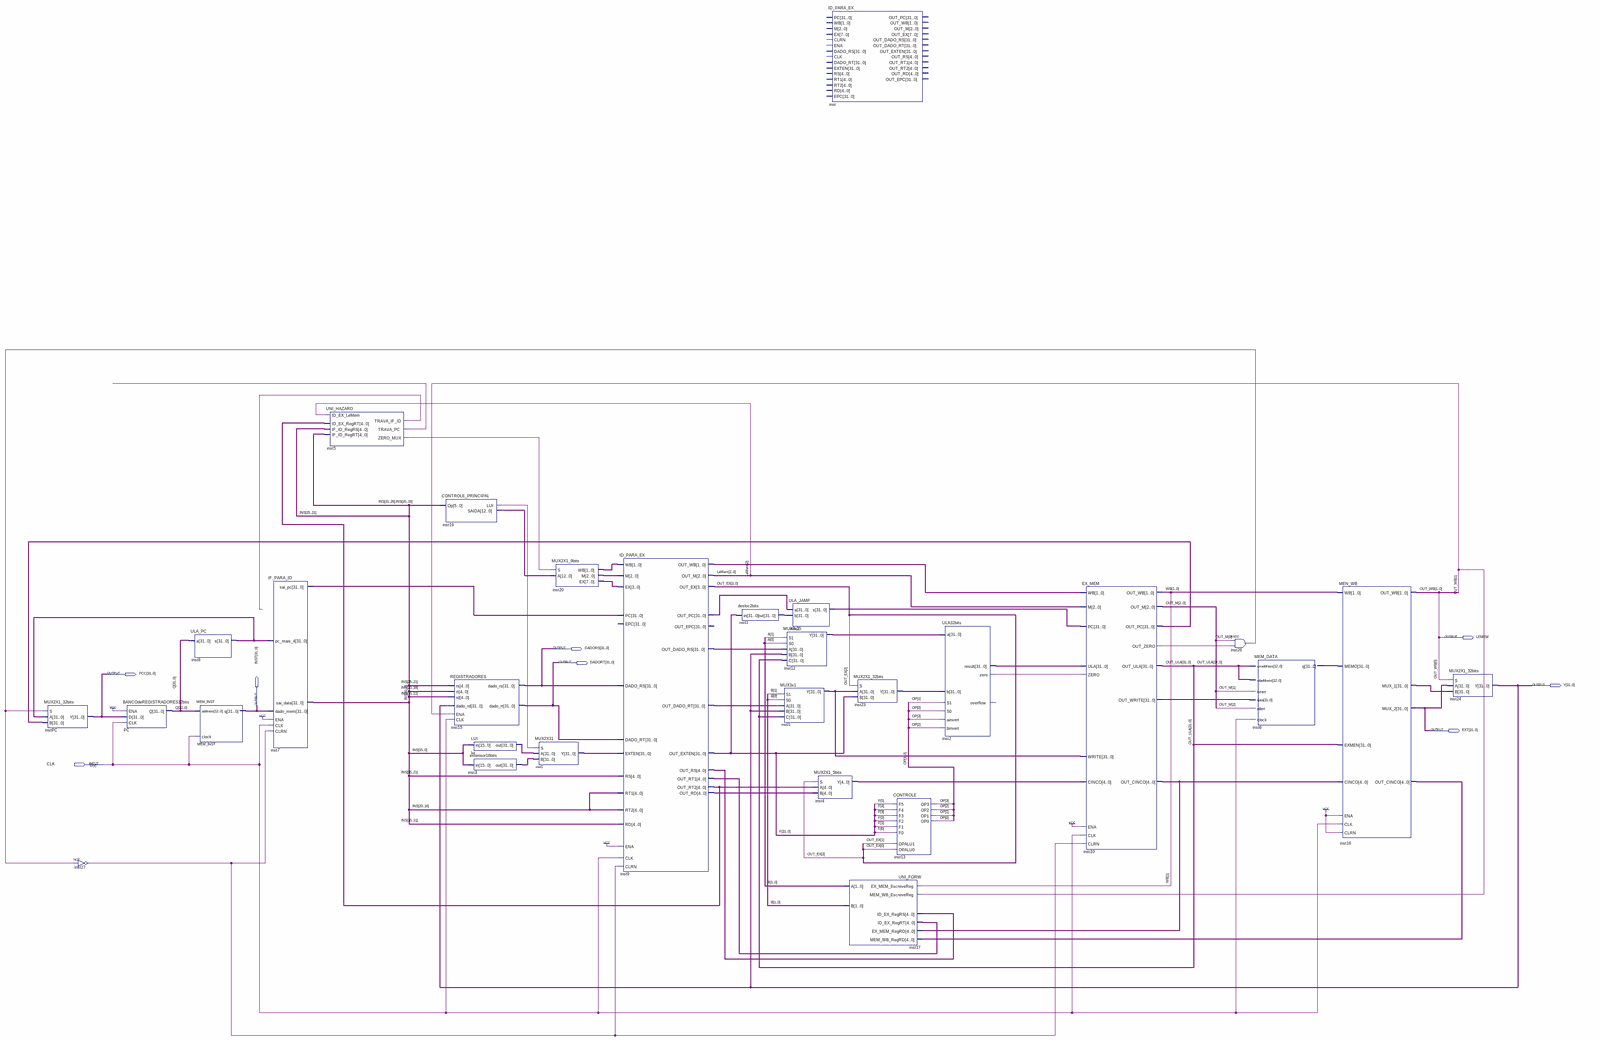
[diagram p0: schematic sheet, whole]
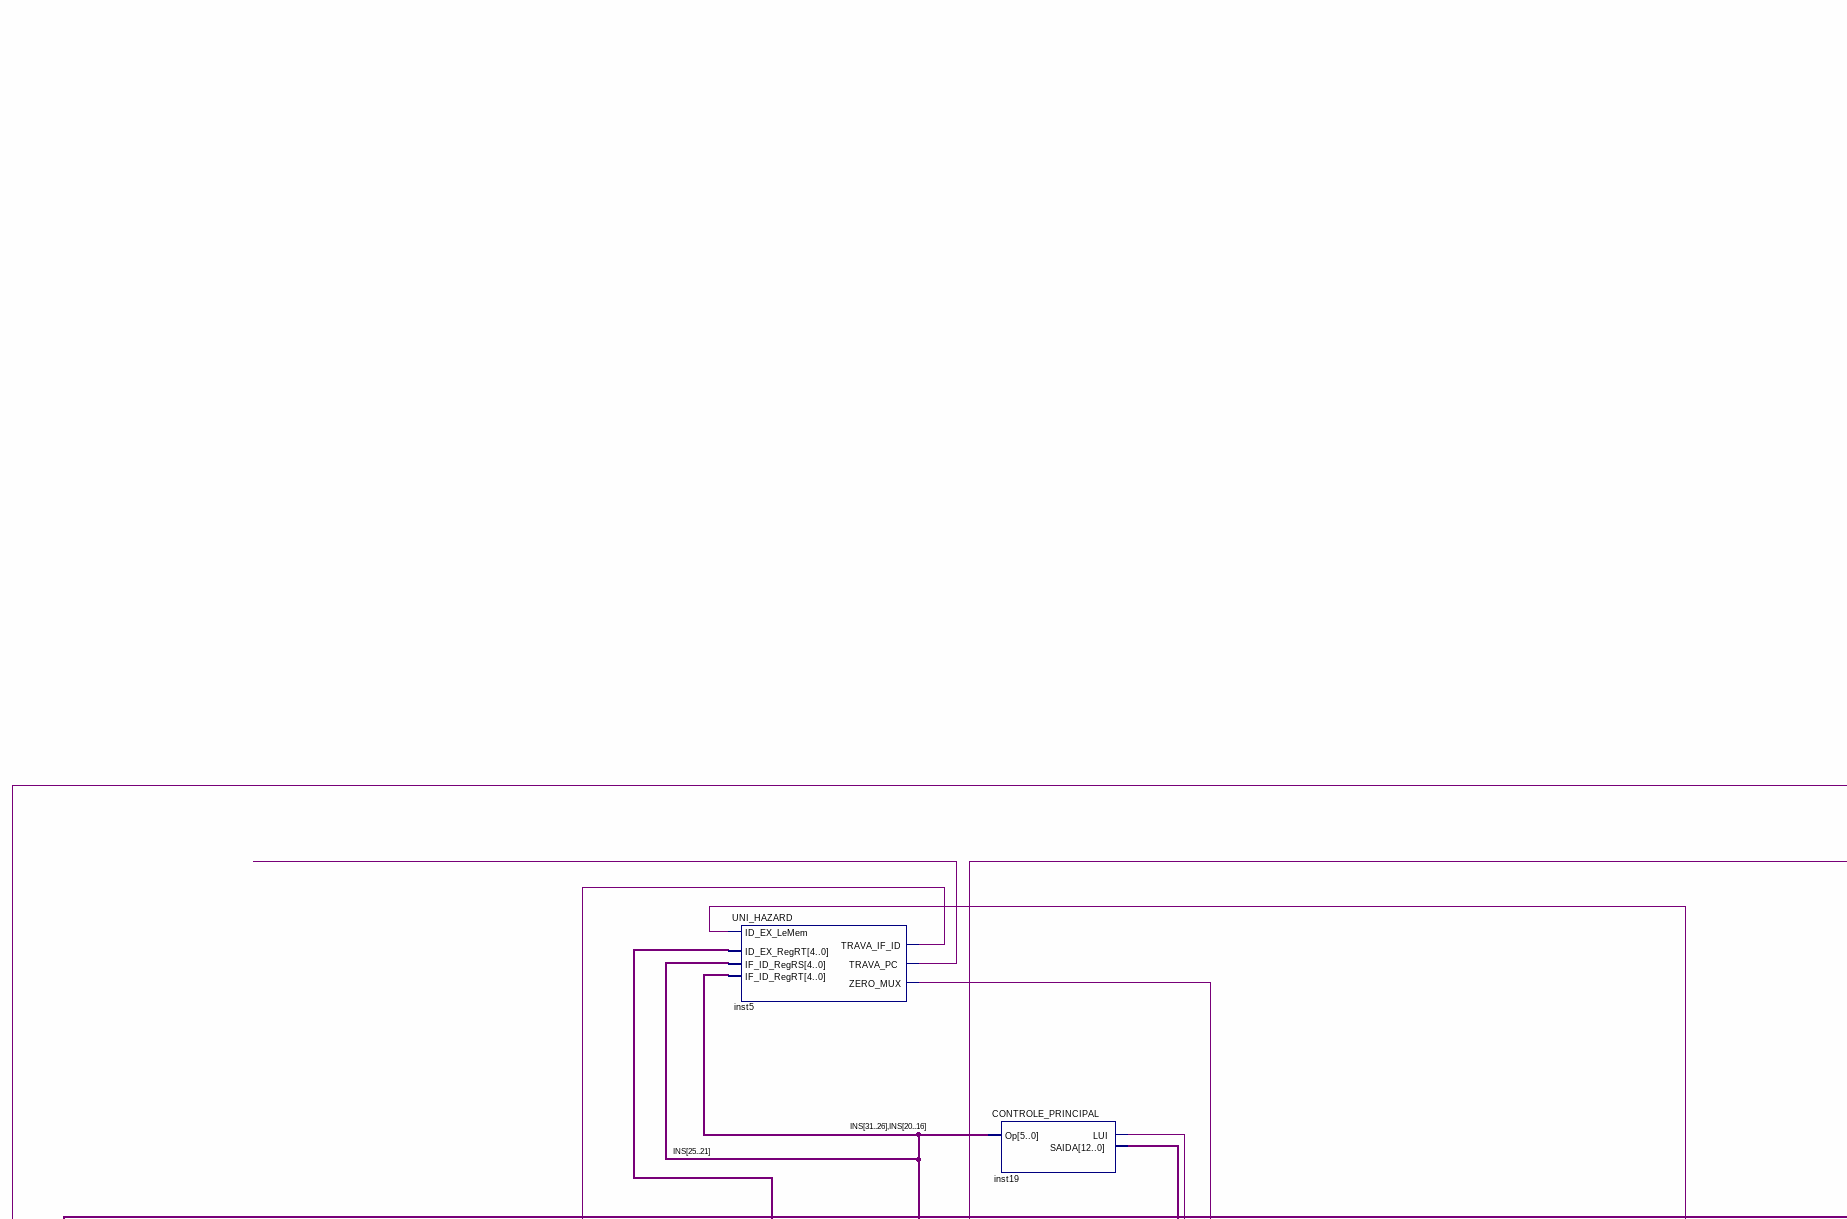
[diagram p1: schematic sheet, upper left part]
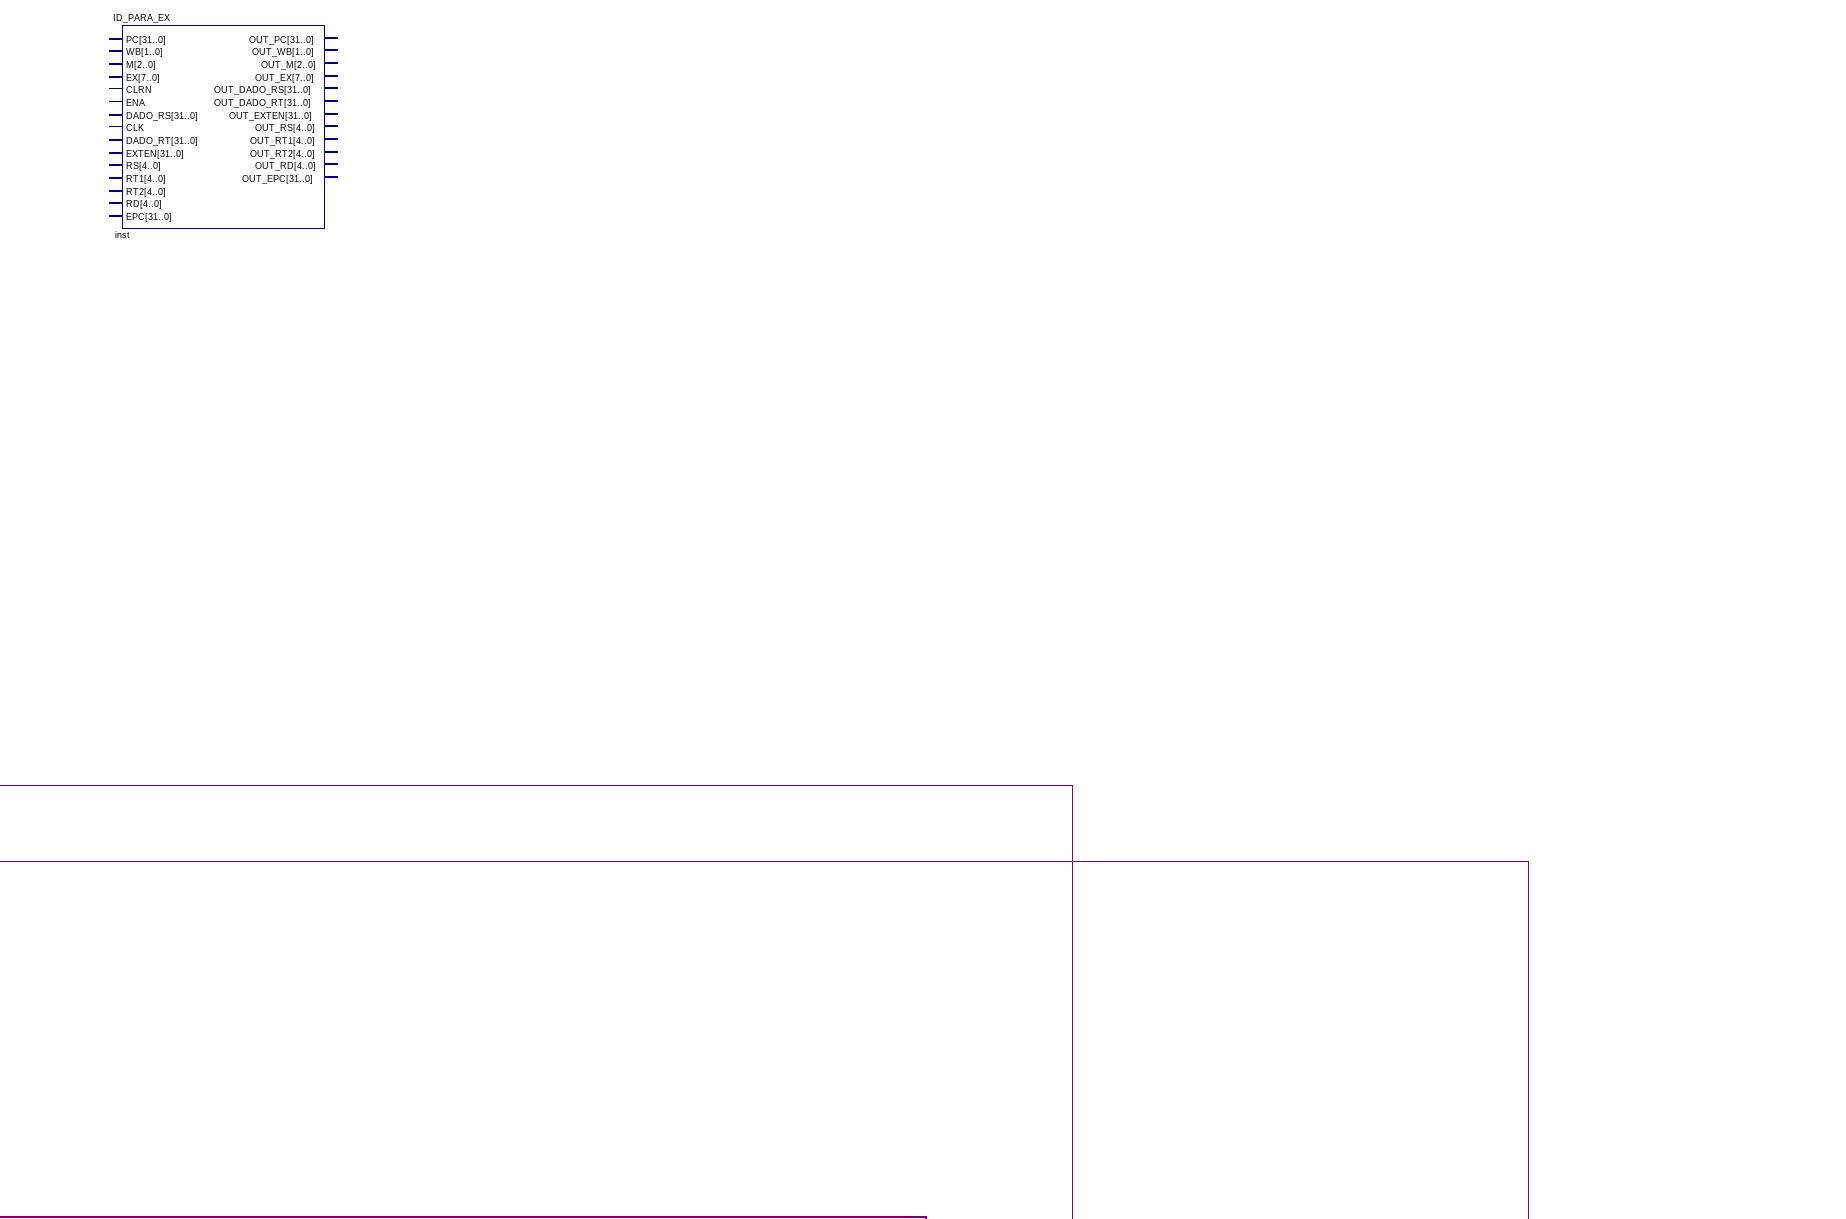
[diagram p2: schematic sheet, upper right part]
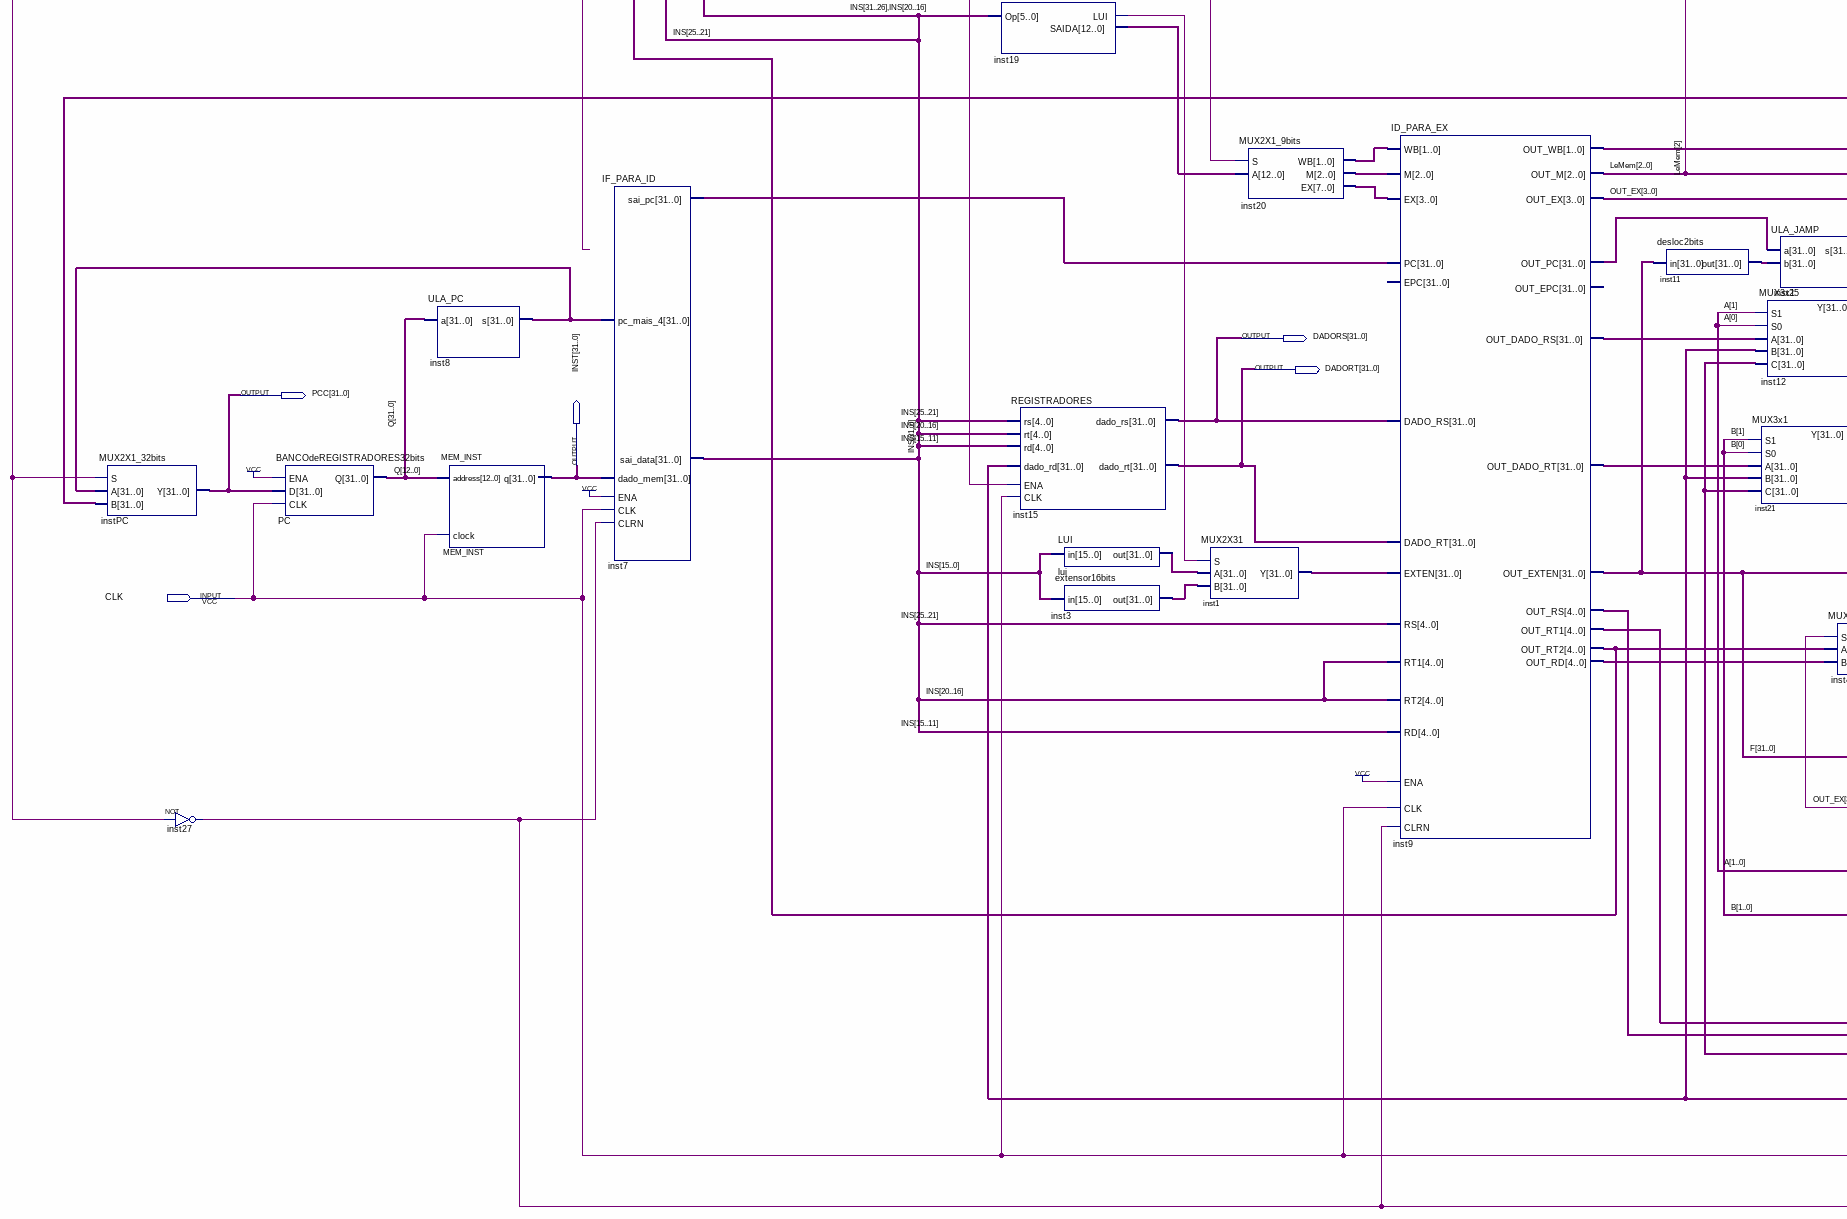
[diagram p3: schematic sheet, lower left part]
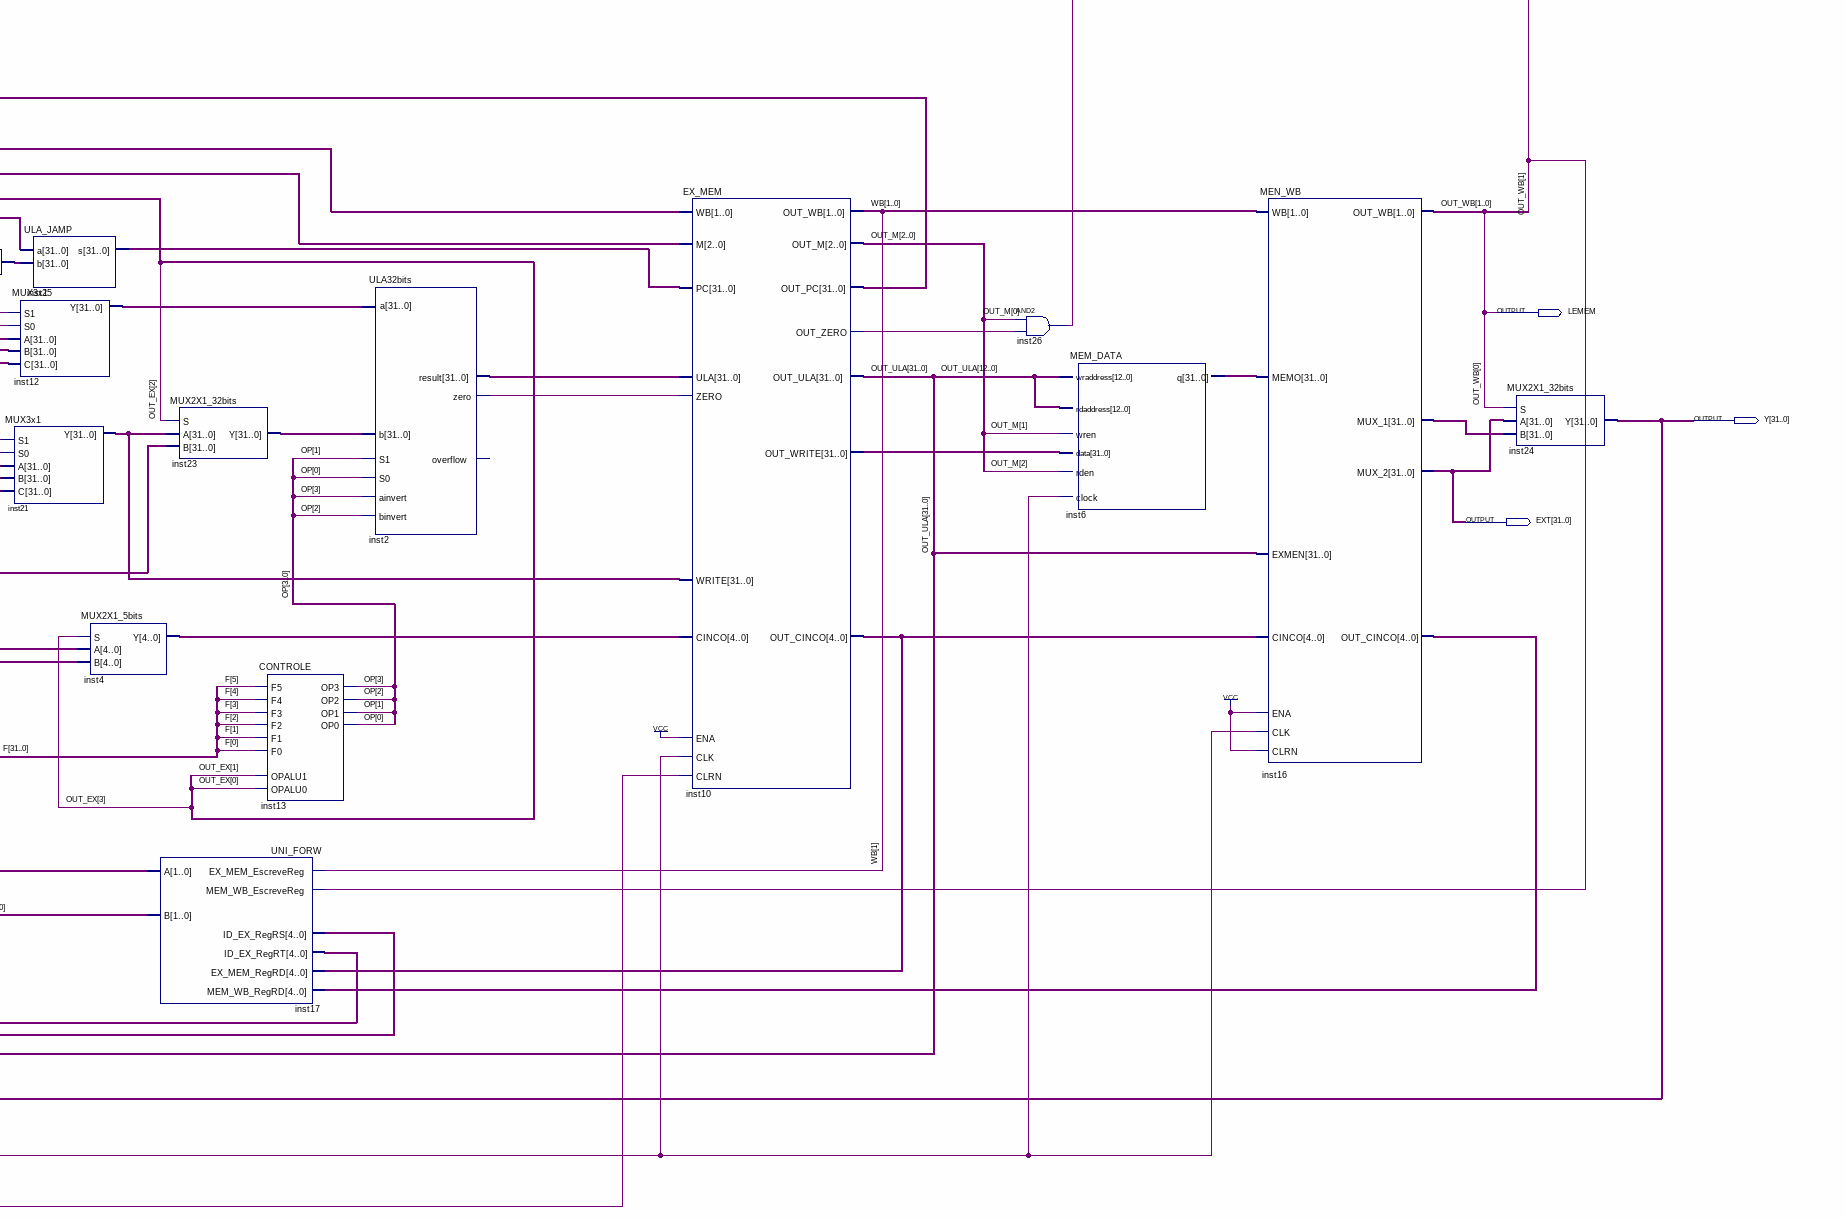
[diagram p4: schematic sheet, lower right part]
// Quartus schematic PRINCIPAL.bdf as structural Verilog: 29 symbols, 8 pins
module PRINCIPAL (
  input  CLK,
  output LEMEM,
  output [31:0] DADORS,
  output [31:0] DADORT,
  output [31:0] PCC,
  output [31:0] Y,
  output [31:0] INST,
  output [31:0] EXT
);

  wire inst2_zero, inst5_trava_if_id, inst5_trava_pc, inst5_zero_mux, inst10_out_zero, inst19_lui,
       inst26_out, inst27_out;
  wire [1:0] A, B, inst9_out_wb, inst20_wb, WB;
  wire [1:1] OUT_WB;
  wire [2:0] inst20_m, LEMEM_bus, OUT_M;
  wire [3:0] OP, OUT_EX;
  wire [4:0] inst4_y, inst9_out_rd, inst9_out_rs, inst9_out_rt1, inst9_out_rt2, inst10_out_cinco,
       inst16_out_cinco;
  wire [7:0] inst20_ex;
  wire [12:0] inst19_saida;
  wire [31:0] F, INS, inst1_y, inst2_result, inst3_out, inst6_q, inst7_sai_pc, inst8_s, inst9_out_dado_rs,
       inst9_out_dado_rt, inst9_out_pc, inst10_out_pc, inst10_out_write, inst11_out, inst12_y, inst16_mux_1,
       inst21_y, inst23_y, inst25_s, lui_out, OUT_ULA, Q;

  MUX2X1_32bits instPC (.S(inst26_out), .A(inst8_s), .B(inst10_out_pc), .Y(PCC));
  not inst27 (inst27_out, inst26_out);
  BANCOdeREGISTRADORES32bits PC (.ENA(1'b1), .D(PCC), .CLK(CLK), .Q(Q));
  ULA_PC inst8 (.a(Q), .s(inst8_s));
  MEM_INST MEM_INST (.address(Q[12:0]), .clock(CLK), .q(INST));
  IF_PARA_ID inst7 (
    .ENA(1'b1), .CLK(CLK), .CLRN(inst27_out), .pc_mais_4(inst8_s), .dado_mem(INST), .sai_pc(inst7_sai_pc),
    .sai_data(INS));
  UNI_HAZARD inst5 (
    .ID_EX_RegRT(inst9_out_rt2), .IF_ID_RegRS(INS[25:21]), .ID_EX_LeMem(LEMEM_bus[2]),
    .IF_ID_RegRT({INS[31:26], INS[20:16]}), .TRAVA_PC(inst5_trava_pc), .ZERO_MUX(inst5_zero_mux),
    .TRAVA_IF_ID(inst5_trava_if_id));
  CONTROLE_PRINCIPAL inst19 (.Op(INS), .LUI(inst19_lui), .SAIDA(inst19_saida));
  REGISTRADORES inst15 (
    .CLK(CLK), .ENA(OUT_WB[1]), .rs(INS[25:21]), .rd(INS[15:11]), .dado_rd(Y), .rt(INS[20:16]),
    .dado_rs(DADORS), .dado_rt(DADORT));
  LUI lui (.in(INS[15:0]), .out(lui_out));
  extensor16bits inst3 (.in(INS[15:0]), .out(inst3_out));
  MUX2X31 inst1 (.S(inst19_lui), .A(lui_out), .B(inst3_out), .Y(inst1_y));
  MUX2X1_9bits inst20 (.S(inst5_zero_mux), .A(inst19_saida), .WB(inst20_wb), .M(inst20_m), .EX(inst20_ex));
  ID_PARA_EX inst9 (
    .PC(inst7_sai_pc), .WB(inst20_wb), .M(inst20_m), .EX(inst20_ex), .CLRN(inst27_out), .ENA(1'b1),
    .DADO_RS(DADORS), .CLK(CLK), .DADO_RT(DADORT), .EXTEN(inst1_y), .RS(INS[25:21]), .RT1(INS[20:16]),
    .RT2(INS[20:16]), .RD(INS[15:11]), .OUT_PC(inst9_out_pc), .OUT_WB(inst9_out_wb), .OUT_M(LEMEM_bus),
    .OUT_EX(OUT_EX), .OUT_DADO_RS(inst9_out_dado_rs), .OUT_DADO_RT(inst9_out_dado_rt), .OUT_EXTEN(F),
    .OUT_RS(inst9_out_rs), .OUT_RT1(inst9_out_rt1), .OUT_RT2(inst9_out_rt2), .OUT_RD(inst9_out_rd));  // open: EPC, OUT_EPC
  desloc2bits inst11 (.in(F), .out(inst11_out));
  ULA_JAMP inst25 (.a(inst9_out_pc), .b(inst11_out), .s(inst25_s));
  MUX3x1 inst12 (.S1(A[1]), .S0(A[0]), .C(OUT_ULA), .B(Y), .A(inst9_out_dado_rs), .Y(inst12_y));
  MUX3x1 inst21 (.S1(B[1]), .S0(B[0]), .C(OUT_ULA), .B(Y), .A(inst9_out_dado_rt), .Y(inst21_y));
  MUX2X1_5bits inst4 (.S(OUT_EX[3]), .A(inst9_out_rt2), .B(inst9_out_rd), .Y(inst4_y));
  ID_PARA_EX u_inst ();  // open: PC, WB, M, EX, CLRN, ENA, DADO_RS, CLK, DADO_RT, EXTEN, RS, RT1, RT2, RD, EPC, OUT_PC, OUT_WB, OUT_M, OUT_EX, OUT_DADO_RS, OUT_DADO_RT, OUT_EXTEN, OUT_RS, OUT_RT1, OUT_RT2, OUT_RD, OUT_EPC
  MUX2X1_32bits inst23 (.S(OUT_EX[2]), .A(inst21_y), .B(F), .Y(inst23_y));
  UNI_FORW inst17 (
    .EX_MEM_EscreveReg(WB[1]), .EX_MEM_RegRD(inst10_out_cinco), .ID_EX_RegRS(inst9_out_rs),
    .ID_EX_RegRT(inst9_out_rt1), .MEM_WB_EscreveReg(OUT_WB[1]), .MEM_WB_RegRD(inst16_out_cinco), .A(A), .B(B));
  CONTROLE inst13 (
    .F5(F[5]), .F4(F[4]), .F3(F[3]), .F2(F[2]), .F1(F[1]), .OPALU0(OUT_EX[0]), .OPALU1(OUT_EX[1]), .F0(F[0]),
    .OP3(OP[3]), .OP2(OP[2]), .OP1(OP[1]), .OP0(OP[0]));
  ULA32bits inst2 (
    .S1(OP[1]), .S0(OP[0]), .ainvert(OP[3]), .binvert(OP[2]), .a(inst12_y), .b(inst23_y),
    .result(inst2_result), .zero(inst2_zero));  // open: overflow
  EX_MEM inst10 (
    .WB(inst9_out_wb), .CLRN(inst27_out), .CLK(CLK), .M(LEMEM_bus), .ENA(1'b1), .ZERO(inst2_zero),
    .ULA(inst2_result), .CINCO(inst4_y), .WRITE(inst21_y), .PC(inst25_s), .OUT_WB(WB), .OUT_M(OUT_M),
    .OUT_ZERO(inst10_out_zero), .OUT_ULA(OUT_ULA), .OUT_CINCO(inst10_out_cinco),
    .OUT_WRITE(inst10_out_write), .OUT_PC(inst10_out_pc));
  and inst26 (inst26_out, OUT_M[0], inst10_out_zero);
  MEM_DATA inst6 (
    .clock(CLK), .data(inst10_out_write), .rdaddress(OUT_ULA[12:0]), .rden(OUT_M[2]),
    .wraddress(OUT_ULA[12:0]), .wren(OUT_M[1]), .q(inst6_q));
  MEN_WB inst16 (
    .WB(WB), .CLRN(1'b1), .CLK(CLK), .ENA(1'b1), .MEMO(inst6_q), .EXMEN(OUT_ULA), .CINCO(inst10_out_cinco),
    .OUT_WB({OUT_WB[1], LEMEM}), .MUX_1(inst16_mux_1), .MUX_2(EXT), .OUT_CINCO(inst16_out_cinco));
  MUX2X1_32bits inst24 (.S(LEMEM), .A(EXT), .B(inst16_mux_1), .Y(Y));

  // Other names for the same wires on the sheet: OUT_WB[0] = LEMEM
endmodule
